# Altium schematic sheet H-BRIDGE-SCH.SchDoc
size A; SheetNumber: 2; SheetTotal: 2
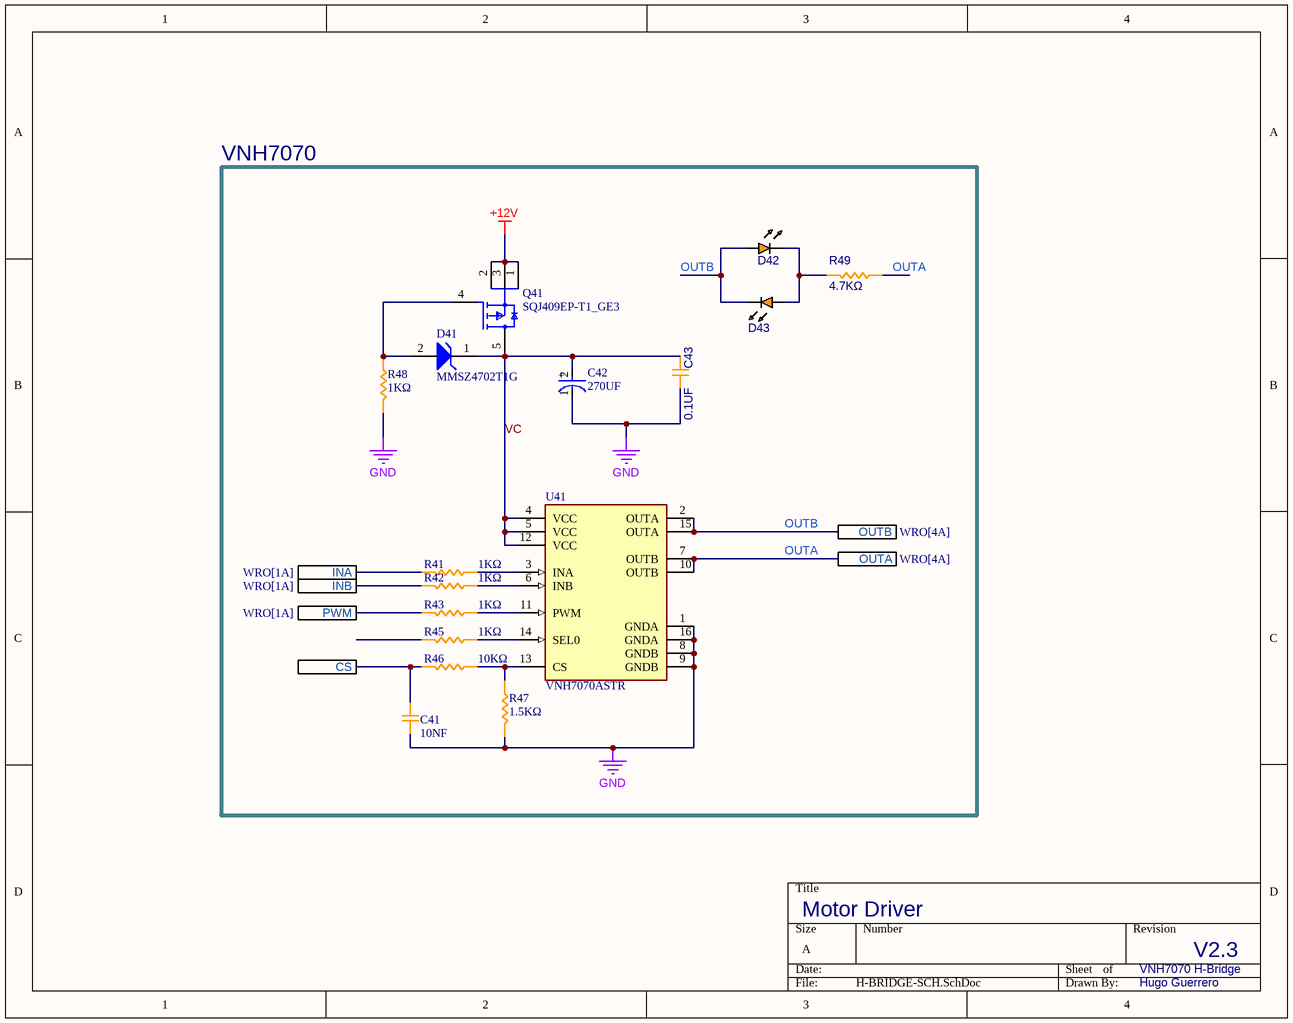
[diagram p0: H-BRIDGE-SCH.SchDoc]

## Parts
C41  10NF  [CAP_0603]
C42  270UF  [FP-FTD8-MFG]
C43  0.1UF  [CAP_0603]
D41  MMSZ4702T1G  [ONSC-SOD-123-2-425-04_V]
D42  LED_0603  [LED_0603]  (value not drawn)
D43  LED_0603  [LED_0603]  (value not drawn)
Q41  SQJ409EP-T1_GE3  [FP-T16-0221-SINGLE-MFG]
R41  1KΩ  [RES_0603]
R42  1KΩ  [RES_0603]
R43  1KΩ  [RES_0603]
R45  1KΩ  [RES_0603]
R46  10KΩ  [RES_0603]
R47  1.5KΩ  [RES_0603]
R48  1KΩ  [RES_0603]
R49  4.7KΩ  [RES_0603]
U41  VNH7070ASTR  [FP-SO-16N-GAPGCFT00818-MFG]

## Blocks framed on the sheet
VNH7070: C41-C43 D41-D43 Q41 R41-R43 R45-R49 U41

## Ports
CS, INA (see WRO[1A]), INB (see WRO[1A]), OUTA (see WRO[4A]), OUTB (see WRO[4A]), PWM (see WRO[1A])

## Nets
+12V: Q41.1(S) Q41.2(S) Q41.3(S)
GND: C41.1 C42.1(C) C43.2 R47.1 R48.1 U41.1(GNDA) U41.8(GNDB) U41.9(GNDB) U41.16(GNDA)
CS: C41.2 R46.1 ; port CS
INA: R41.1 ; port INA
INB: R42.1 ; port INB
OUTA: R49.2 U41.7(OUTB) U41.10(OUTB) ; port OUTA
OUTB: D42.A D43.C U41.2(OUTA) U41.15(OUTA) ; port OUTB
PWM: R43.1 ; port PWM
VC: C42.2(A) C43.1 D41.1(K) Q41.5(D) U41.4(VCC) U41.5(VCC) U41.12(VCC)
NetD41_2: D41.2(A) Q41.4(G) R48.2
NetD42_C: D42.C D43.A R49.1
NetR41_2: R41.2 U41.3(INA)
NetR42_2: R42.2 U41.6(INB)
NetR43_2: R43.2 U41.11(PWM)
NetR45_2: R45.2 U41.14(SEL0)
NetR46_2: R46.2 R47.2 U41.13(CS)

Not connected (* = marked no-connect by the designer): R45 1

## Notes on the sheet
- Motor Driver
- VNH7070 H-Bridge
- V2.3
- Hugo Guerrero
- (in symbol CMP-05427-000088-1) +

## Library data of the parts
C41 C43 = CAP_0603: Capacitor SMD 0603 generic
C42 = CMP-05427-000088-1: CAP ALUM 220UF 20% 25V SMD; Dielectric Material: Aluminium; ESR (Equivalent Series Resistance): 160mR; Ripple Current: 600mA; Life (Hours): 2000Hour; Leakage Current: 55uA; Lead Diameter: 0.65mm; Series: FT; RoHS Compliant: Yes; Case/Package: Radial; Packaging: Tape and Reel; Contact Plating: Tin; Package Quantity: 1; Mount: Surface Mount; Number of Pins: 8; Tolerance: 20%; Height - Seated (Max): 0.315inch; Length: 7.7mm; Lead Free: Lead Free; Voltage: 25V; Construction: Cylindrical; Radiation Hardening: No; Lead Pitch: 1.8mm; REACH SVHC: No SVHC; Capacitance: 220uF; Voltage Rating: 25V; Height: 7.7mm; Diameter: 6.3mm; Max Operating Temperature: 105°C; Termination: SMD/SMT; Min Operating Temperature: -55°C; Voltage Rating (DC): 25V; Ripple Current (AC): 600mA
D41 = CMP-1060-00296-1: Zener Voltage Regulator, 500 mW, 2-Pin SOD-123, Pb-Free, Tape and Reel; Manufacturer: On Semiconductor; VZ Typ (V): 15; P Max (W): 0.5; PackageVersion: Rev. G, 10/2009; ComponentLink3URL: http://www.onsemi.com/pub_link/Collateral/425-04.PDF; PackageReference: SOD-123-2-425-04; ComponentLink2URL: http://www.onsemi.com/pub_link/Collateral/MMSZ4678T1-D.PDF; PartNumber: MMSZ4702T1G; ComponentLink3Description: Package Specification; PackageDescription: 2-Pin SOD, Body 1.6 x 2.69 mm; ComponentLink1Description: Manufacturer URL; ComponentLink1URL: http://www.onsemi.com/; ComponentLink2Description: Datasheet; DatasheetVersion: Rev. 9; Packing: Tape and Reel; Mounting Technology: Surface Mount; RoHS: Pb-Free
Q41 = CMP-02550-000144-1: MOSFET P-CH 40V 60A POWERPAKSO-8; Manufacturer: Vishay; Number Of P Channels: 1; Reverse Recovery Time: 39ns; Standoff Height: 0mm; Automotive Grade: Grade 0; Continuous Drain Current: -60A; Gate Charge At Vgs: 170nC @ -10V; Power Dissipation: 68W; Input Capacitace At Vds: 8400pF @ -25V; Drain To Source Resistance: 0.0058Ω; Depletion Mode: False; Rthja Max: 68°C/W; Gate To Source Voltage: 20V; Drain To Source Voltage: -40V; Threshold Vgs Max: -2.5V; Turn Off Delay Time: 75ns; Threshold Vgs Min: -1.5V; Reverse Recovery Charge: 45nC; Turn On Delay Time: 23ns; Typ Forward Diode Voltage: -0.76V; Transconductance: 54S; Max Junction Temp: +175°C; Max Forward Diode Voltage: -1.2V; Pulse Drain Current: -150A; Digikey Description: MOSFET P-CH 40V 60A POWERPAKSO-8; Device Class L2: Transistors; Height: 1.267mm; Octopart: https://octopart.com/sqj409ep-t1_ge3-vishay-82218774; Device Class L3: MOSFETs; ComponentLink2URL: https://www.vishay.com/docs/77707/sqj409ep.pdf; ComponentLink2Description: Datasheet; Footprint Url: http://www.vishay.com/docs/63818/ppso8ls.pdf; Device Class L1: Discrete Semiconductors; Temperature: -55°C to +175°C; Package: T16-0221-SINGLE; Drain To Source Breakdown Voltage: -40V; Automotive: Yes; Manufacturer Part Number: SQJ409EP-T1_GE3; Temperature Range High: +175°C; Mouser Description: Trans MOSFET P-CH 40V 60A Automotive 5-Pin(4+Tab) PowerPAK SO T/R; RoHS: TRUE; Temperature Range Low: -55°C; Category: Trans; Lead Free: Yes; Number Of Channels: 1
R41-R43 R45-R49 = RES_0603: Resistor SMD 0603 generic
U41 = CMP-2000-07519-2: IC MOTOR DRIVER 4V-28V 16SOIC; Manufacturer: STMicroelectronics; Standoff Height: 0.1mm; Number Of Outputs: 2; Max Junction Temp: +150°C; Output Current: 15A; Max Supply Voltage: 28V; Automotive Grade: Grade 0; Motor Type: Brushed; Min Supply Voltage: 4V; Nominal Supply Current: 2-3.5mA; Digikey Description: IC MOTOR DRIVER 4V-28V 16SOIC; Device Class L1: Integrated Circuits (ICs); Ipc Land Pattern Name: SOIC127P600X175-16; Device Class L2: Power Management ICs; ComponentLink2Description: Datasheet; ComponentLink2URL: https://www.st.com/resource/en/datasheet/vnh7070as.pdf; Height: 1.75mm; RoHS: TRUE; Manufacturer Part Number: VNH7070ASTR; Octopart: https://octopart.com/vnh7070astr-stmicroelectronics-66668687; Temperature Range Low: -40°C; Mouser Description: STMicroelectronics VNH7070ASTR Motor Driver IC 16-Pin, SOIC; Device Class L3: Motor Drivers; Lead Free: Yes; Temperature: -40°C to +150°C; Automotive: Yes; Package: SO-16N-GAPGCFT00818; Temperature Range High: +150°C; Category: IC; Footprint Url: https://www.st.com/resource/en/datasheet/l6566a.pdf